# EAGLE design RCU_PCB (EAGLE 9.6.1)

## Sheet 1 of 3
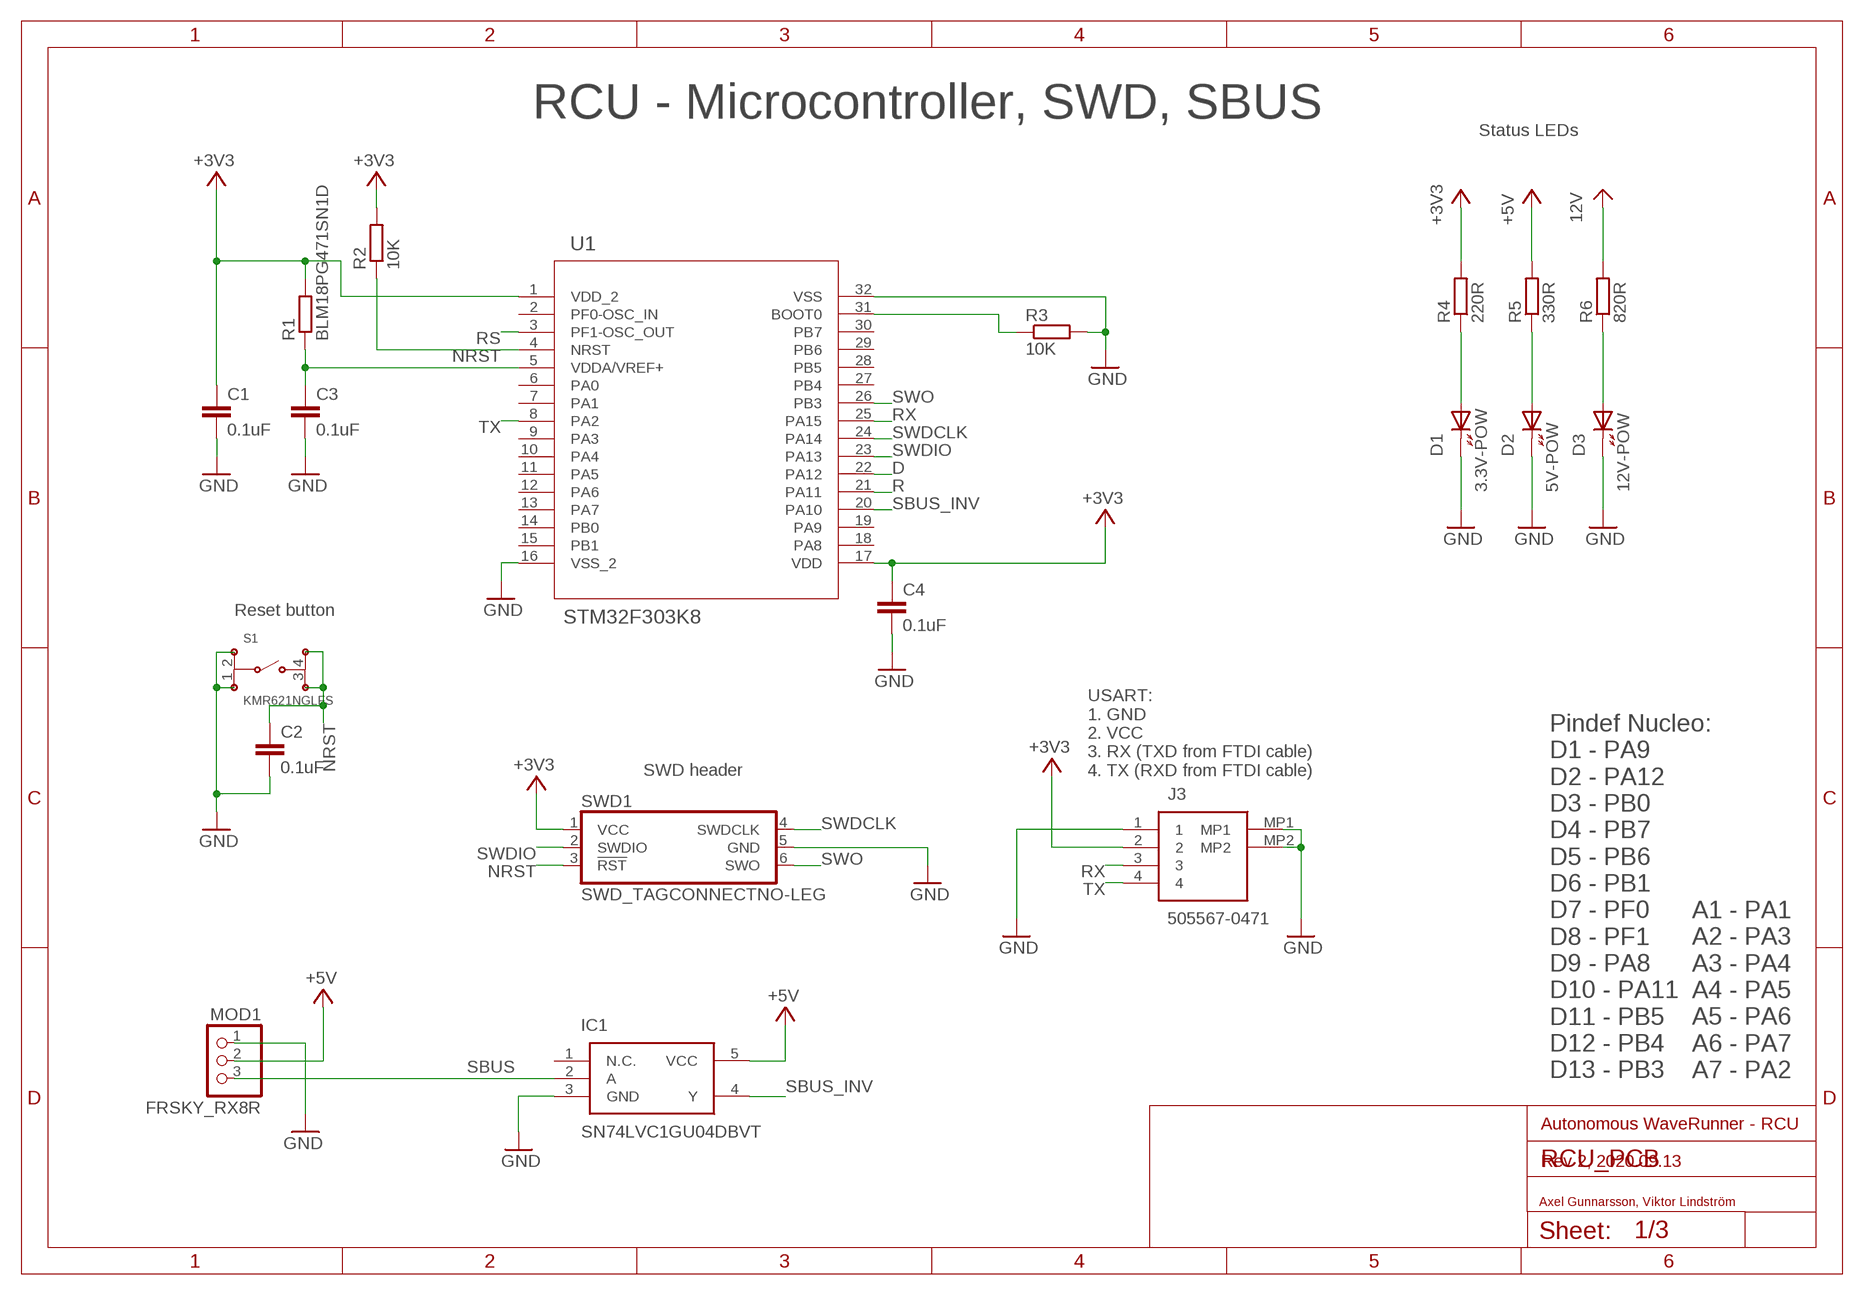
[diagram p0: schematic, sheet 1]

### Parts
C1  0.1uF  C0603  [C0603]
C2  0.1uF  C0603  [C0603]
C3  0.1uF  C0603  [C0603]
C4  0.1uF  C0603  [C0603]
D1  3.3V-POW  CHIP-LED0805  [CHIP-LED0805]
D2  5V-POW  CHIP-LED0805  [CHIP-LED0805]
D3  12V-POW  CHIP-LED0805  [CHIP-LED0805]
IC1  SN74LVC1GU04DBVT  [SOT95P280X145-5N]
J3  505567-0471  [5055680471]
MOD1  FRSKY_RX8R  [FRSKY_RX8R]
R1  BLM18PG471SN1D  R0603  [R0603]
R2  10K  R0603  [R0603]
R3  10K  R0603  [R0603]
R4  220R  R0603  [R0603]
R5  330R  R0603  [R0603]
R6  820R  R0603  [R0603]
S1  KMR621NGLFS  [KMR621NGLFS]
SWD1  SWD_TAGCONNECTNO-LEG  [TC2030-IDC-NL]
U1  STM32F303K8  [LQFP-32]

### Nets
12V: R6.2 ; also sheet 2,3
+3V3: C1.1 C4.1 J3.2 R1.2 R2.2 R4.2 SWD1.1(VCC) U1.1(VDD_2) U1.17(VDD) ; also sheet 2,3
+5V: IC1.5(VCC) MOD1.2 R5.2 ; also sheet 2
D: U1.22(PA12) ; also sheet 3
GND: C1.2 C2.2 C3.2 C4.2 D1.C(K) D2.C(K) D3.C(K) IC1.3(GND) J3.1 J3.MP1 J3.MP2 MOD1.1 R3.2 S1.1 S1.2 SWD1.5(GND) U1.16(VSS_2) U1.32(VSS) ; also sheet 2,3
N$10: D3.A R6.1
N$17: D2.A R5.1
N$40: C3.1 R1.1 U1.5(VDDA/VREF+)
N$42: D1.A R4.1
N$61: R3.1 U1.31(BOOT0)
NRST: C2.1 R2.1 S1.3 S1.4 SWD1.3(!RST) U1.4(NRST)
R: U1.21(PA11) ; also sheet 3
RS: U1.3(PF1-OSC_OUT) ; also sheet 3
RX: J3.3 U1.25(PA15)
SBUS: IC1.2(A) MOD1.3
SBUS_INV: IC1.4(Y) U1.20(PA10)
SWDCLK: SWD1.4(SWDCLK) U1.24(PA14)
SWDIO: SWD1.2(SWDIO) U1.23(PA13)
SWO: SWD1.6(SWO) U1.26(PB3)
TX: J3.4 U1.8(PA2)
Unconnected: IC1.1(N.C.) U1.2(PF0-OSC_IN) U1.6(PA0) U1.7(PA1) U1.9(PA3) U1.10(PA4) U1.11(PA5) U1.12(PA6) U1.13(PA7) U1.14(PB0) U1.15(PB1) U1.18(PA8) U1.19(PA9) U1.27(PB4) U1.28(PB5) U1.29(PB6) U1.30(PB7)

### Notes on the sheet
- RCU - Microcontroller, SWD, SBUS
- Status LEDs
- Reset button
- SWD header
- USART:
  1. GND
  2. VCC
  3. RX (TXD from FTDI cable)
  4. TX (RXD from FTDI cable)
- Pindef Nucleo:
  D1 - PA9
  D2 - PA12
  D3 - PB0
  D4 - PB7
  D5 - PB6
  D6 - PB1
  D7 - PF0
  D8 - PF1
  D9 - PA8
  D10 - PA11
  D11 - PB5
  D12 - PB4
  D13 - PB3
- A1 - PA1
  A2 - PA3
  A3 - PA4
  A4 - PA5
  A5 - PA6
  A6 - PA7
  A7 - PA2
- Autonomous WaveRunner - RCU
- Rev 2, 2020.09.13
- Axel Gunnarsson, Viktor Lindström

## Sheet 2 of 3
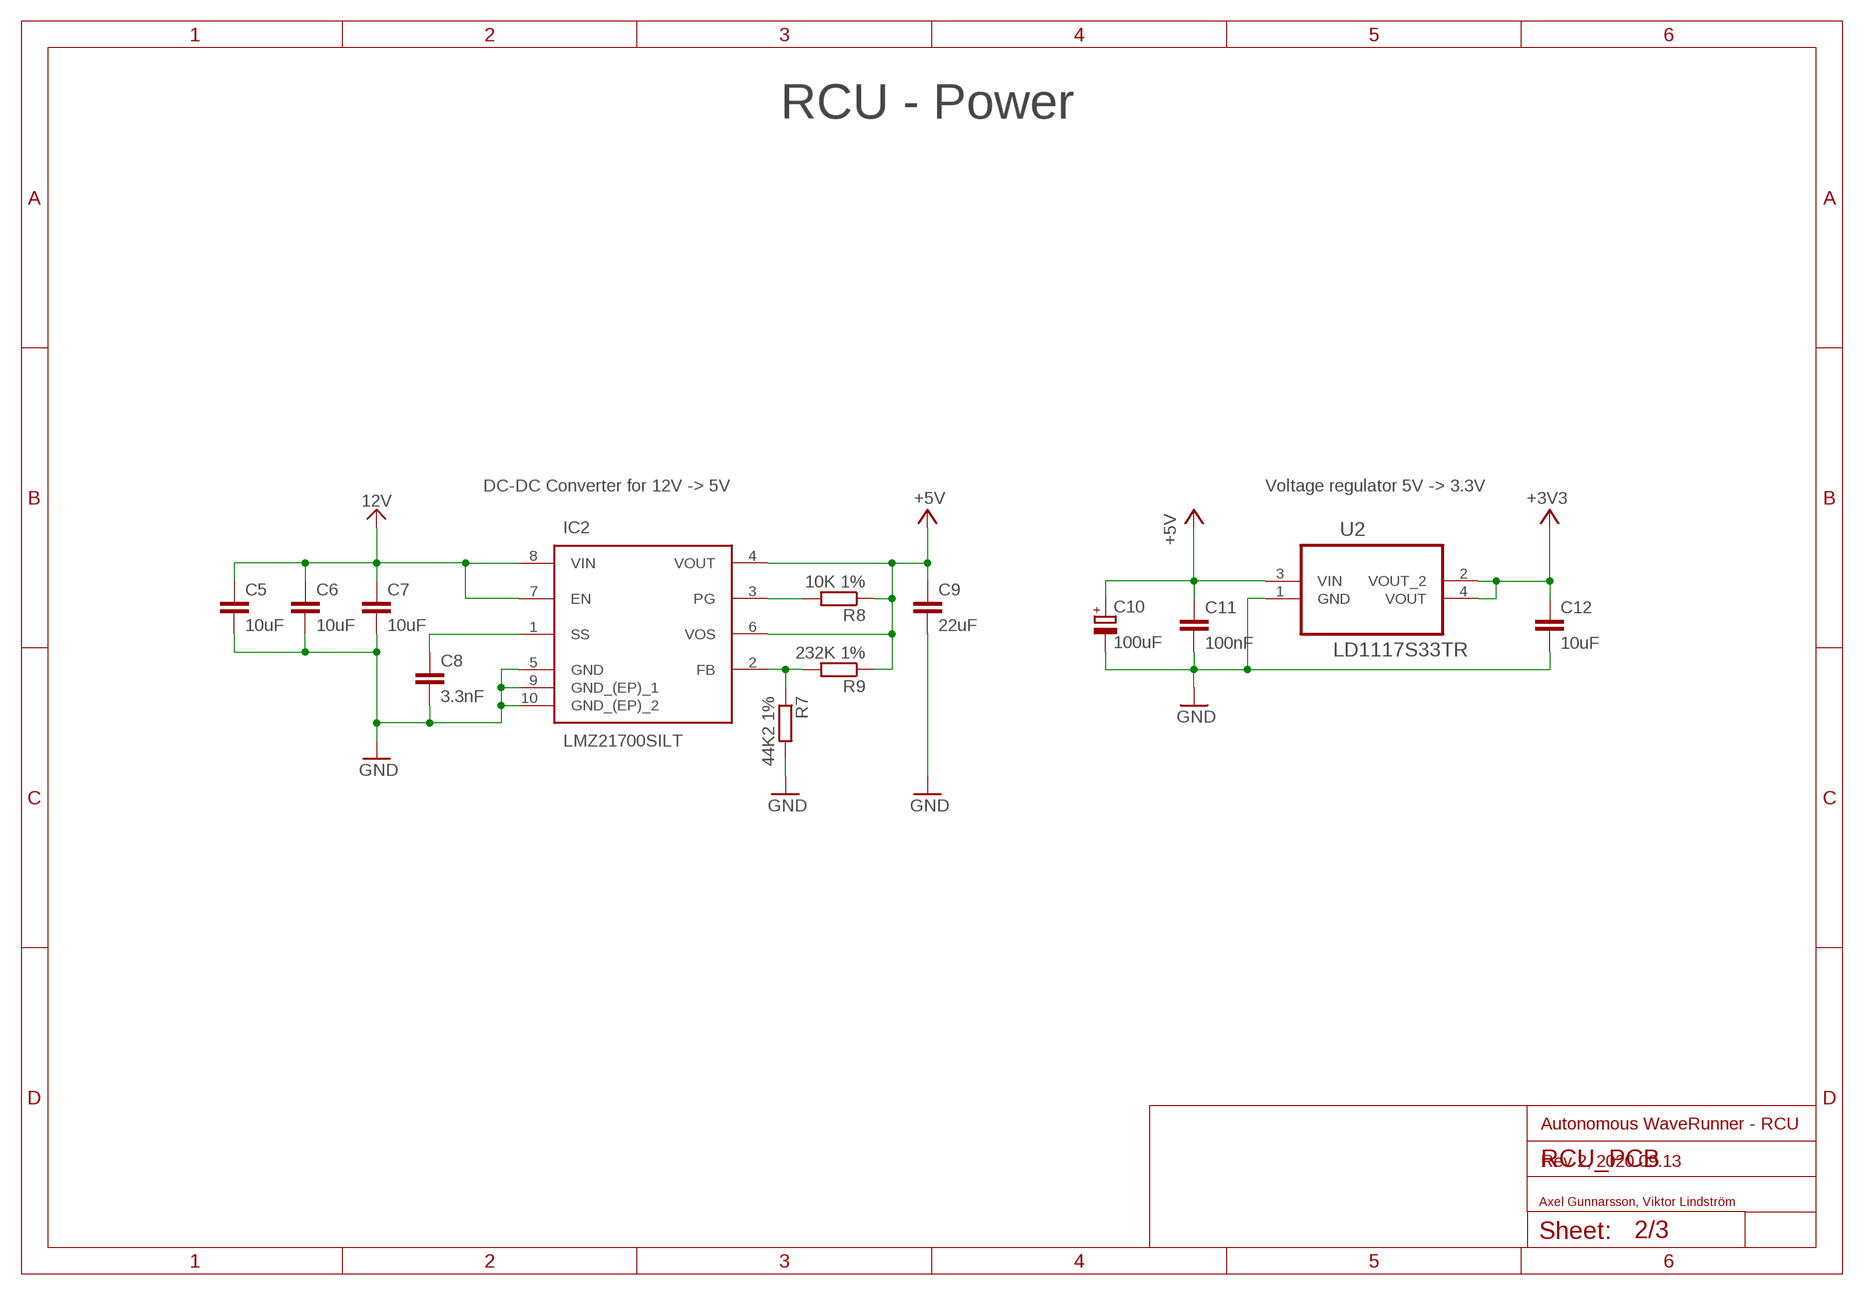
[diagram p1: schematic, sheet 2]

### Parts
C5  10uF  C1206  [C1206]
C6  10uF  C1206  [C1206]
C7  10uF  C1206  [C1206]
C8  3.3nF  C0603  [C0603]
C9  22uF  C0805  [C0805]
C10  100uF  PANASONIC_C  [PANASONIC_C]
C11  100nF  C0603  [C0603]
C12  10uF  C0805  [C0805]
IC2  LMZ21700SILT  [SIL0008E]
R7  44K2 1%  R0603  [R0603]
R8  10K 1%  R0603  [R0603]
R9  232K 1%  R0603  [R0603]
U2  LD1117S33TR  [SOT230P700X180-4N]

### Nets
12V: C5.1 C6.1 C7.1 IC2.7(EN) IC2.8(VIN) ; also sheet 1,3
+3V3: C12.1 U2.2(VOUT_2) U2.4(VOUT) ; also sheet 1,3
+5V: C9.1 C10.+ C11.1 IC2.4(VOUT) IC2.6(VOS) R8.1 R9.1 U2.3(VIN) ; also sheet 1
GND: C5.2 C6.2 C7.2 C8.2 C9.2 C10.- C11.2 C12.2 IC2.5(GND) IC2.9(GND_(EP)_1) IC2.10(GND_(EP)_2) R7.2 U2.1(GND) ; also sheet 1,3
N$5: IC2.2(FB) R7.1 R9.2
N$6: C8.1 IC2.1(SS)
N$11: IC2.3(PG) R8.2

### Notes on the sheet
- RCU - Power
- DC-DC Converter for 12V -> 5V | Voltage regulator 5V -> 3.3V
- Autonomous WaveRunner - RCU
- Rev 2, 2020.09.13
- Axel Gunnarsson, Viktor Lindström

## Sheet 3 of 3
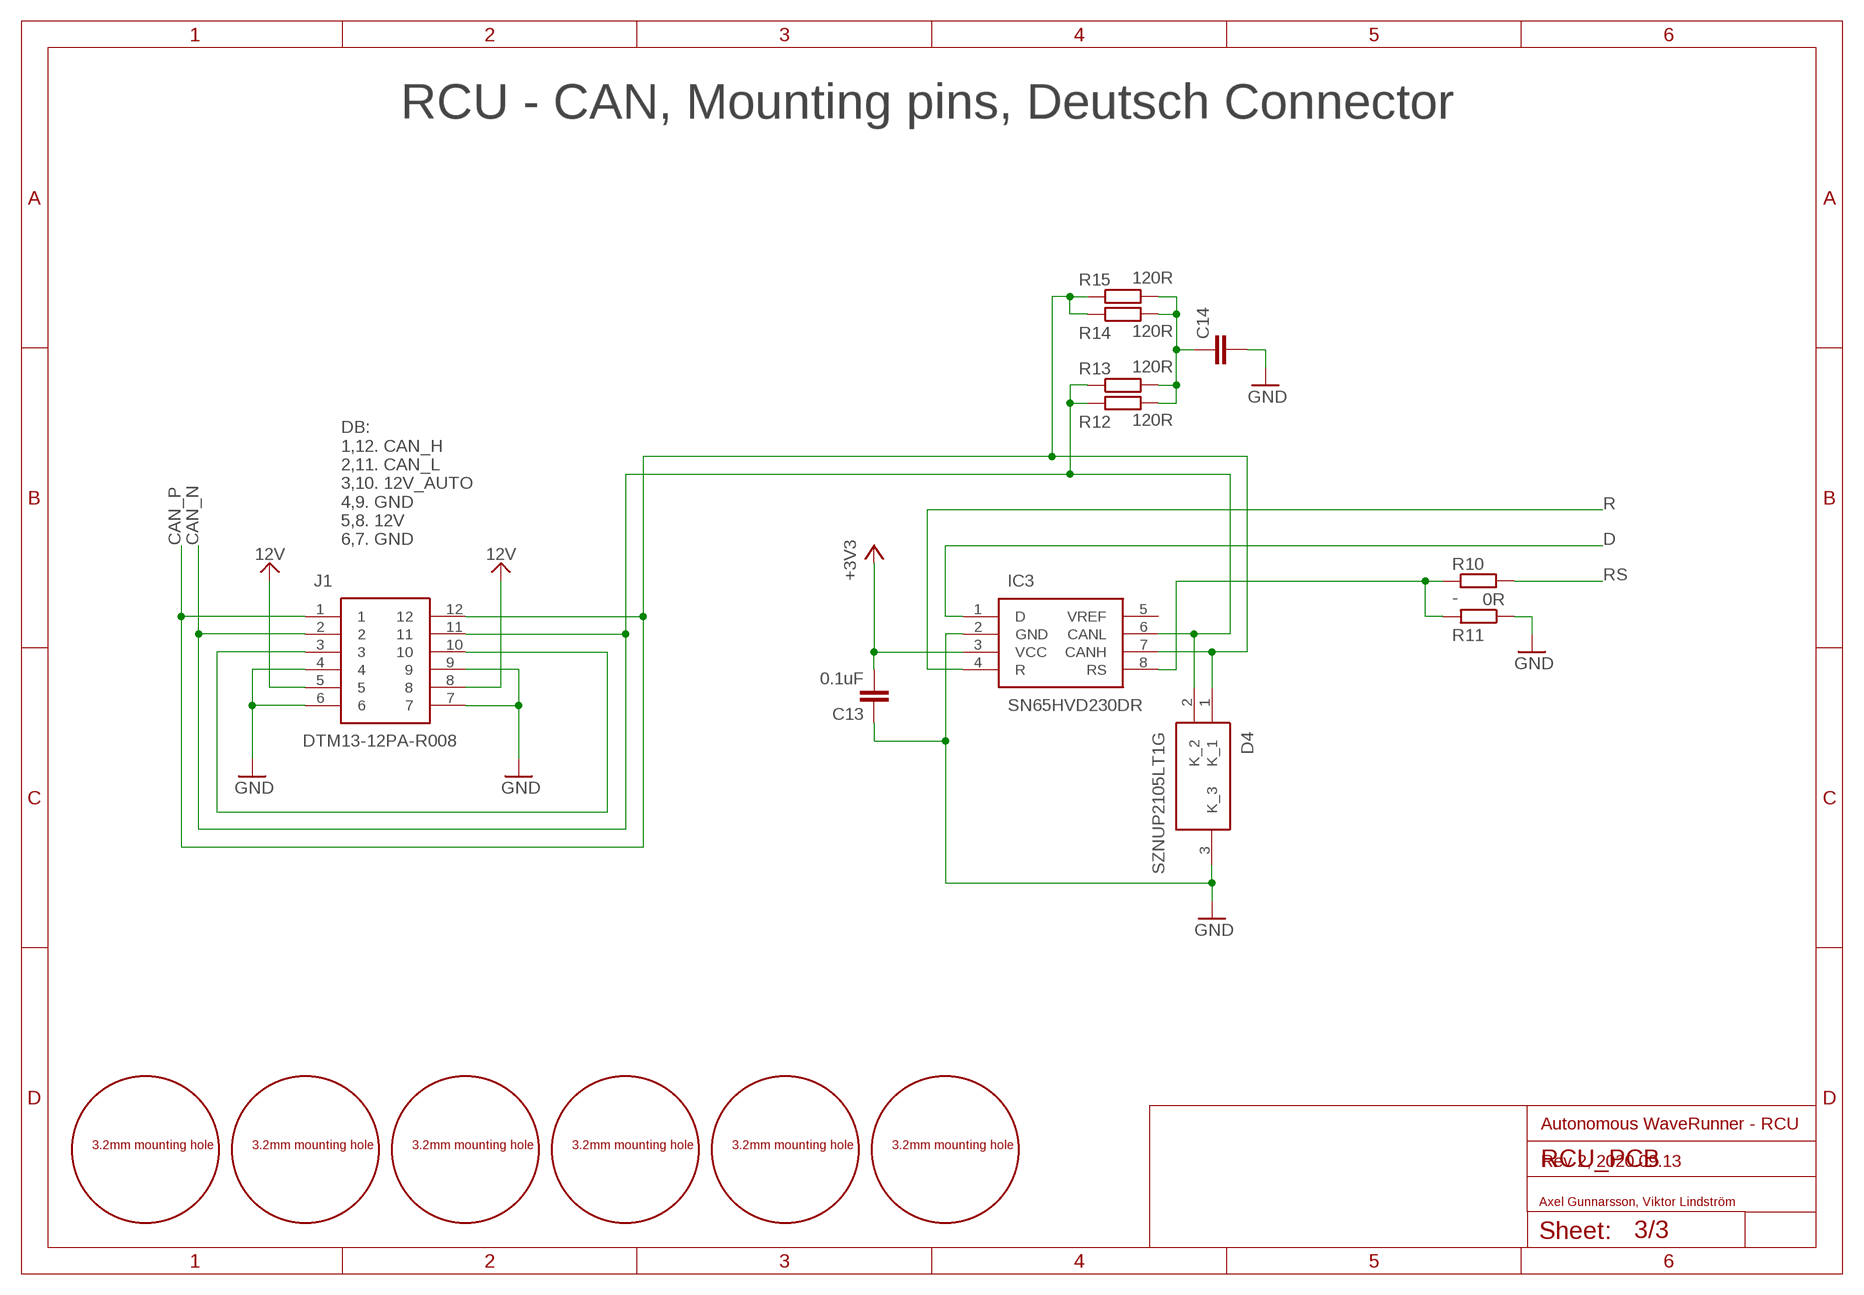
[diagram p2: schematic, sheet 3]

### Parts
C13  0.1uF  C0603  [C0603]
C14  C0805  [C0805]
D4  SZNUP2105LT1G  [SOT96P237X111-3N]
HOLE1  M3_MOUNTING_HOLE  [M3_MOUNTING_HOLE]
HOLE2  M3_MOUNTING_HOLE  [M3_MOUNTING_HOLE]
HOLE3  M3_MOUNTING_HOLE  [M3_MOUNTING_HOLE]
HOLE4  M3_MOUNTING_HOLE  [M3_MOUNTING_HOLE]
HOLE5  M3_MOUNTING_HOLE  [M3_MOUNTING_HOLE]
HOLE6  M3_MOUNTING_HOLE  [M3_MOUNTING_HOLE]
IC3  SN65HVD230DR  [SOT127P600X175-8N]
J1  DTM13-12PA-R008  [DTM1312PAR008]
R10  -  R0603  [R0603]
R11  0R  R0603  [R0603]
R12  120R  R-EU_R1210  [R1210]
R13  120R  R-EU_R1210  [R1210]
R14  120R  R-EU_R1210  [R1210]
R15  120R  R-EU_R1210  [R1210]

### Nets
12V: J1.5 J1.8 ; also sheet 1,2
+3V3: C13.2 IC3.3(VCC) ; also sheet 1,2
CAN_N: D4.2(K_2) IC3.6(CANL) J1.2 J1.11 R12.1 R13.1
CAN_P: D4.1(K_1) IC3.7(CANH) J1.1 J1.12 R14.1 R15.1
D: IC3.1(D) ; also sheet 1
GND: C13.1 C14.2 D4.3(K_3) IC3.2(GND) J1.4 J1.6 J1.7 J1.9 R11.1 ; also sheet 1,2
N$1: C14.1 R12.2 R13.2 R14.2 R15.2
N$7: J1.3 J1.10
N$15: IC3.8(RS) R10.1 R11.2
R: IC3.4(R) ; also sheet 1
RS: R10.2 ; also sheet 1
Unconnected: IC3.5(VREF)

### Notes on the sheet
- RCU - CAN, Mounting pins, Deutsch Connector
- DB:
  1,12. CAN_H
  2,11. CAN_L
  3,10. 12V_AUTO
  4,9. GND 
  5,8. 12V
  6,7. GND
- Autonomous WaveRunner - RCU
- Rev 2, 2020.09.13
- Axel Gunnarsson, Viktor Lindström

## Library data of the parts
C1-C4 C8 C11 C13 = CASE-RCL:C0603: Standard Chip CAPACITOR 0605 (1608 Metric) Description: Standard Chip CAPACITOR 0605 (1608 Metric)
C5-C7 = CASE-RCL:C1206: Standard Chip CAPACITOR 1206 (3216 Metric) Description: Standard Chip CAPACITOR 1206 (3216 Metric)
C9 C12 C14 = CASE-RCL:C0805: Standard Chip CAPACITOR 0805 (2012 Metric) Description: Standard Chip CAPACITOR 0805 (2012 Metric)
C10 = CASE-RCL:PANASONIC_C: Panasonic VS Type Aluminum Electrolytic SMD Capacitors Size C - (TEAPO D5) Description: Size C of VS type SMD capacitor from Panasonic. Diameter of cap = 5mm. (TEAPO D5) Links: TEAPO1 <http://www.farnell.com/datasheets/2622415.pdf?_ga=2.91453018.1951585514.1537363662-1535130828.1530438260> TEAPO2 <http://www.teapo.com.tw/WebSiteFile/Products/Product_Data/EV%20%20SPEC.pdf> PANASONIC <https://industrial.panasonic.com/cdbs/www-data/pdf/RDE0000/DME0000COL92.pdf>
D1-D3 = CASE-LED:CHIP-LED0805: CHIP-LED0805 (SMD) Description: Standard 0805 SMD CHIP-LED
D4 = RescueRunner:SZNUP2105LT1G: Dual Bi-Directional TVS Diode, 350W peak, 3-pin SOT-23 Source: Datasheet <https://componentsearchengine.com/Datasheets/1/SZNUP2105LT1G.pdf>; DESCRIPTION: Dual Bi-Directional TVS Diode, 350W peak, 3-pin SOT-23; HEIGHT: 1.11mm; MANUFACTURER_NAME: ON Semiconductor; MANUFACTURER_PART_NUMBER: SZNUP2105LT1G; MOUSER_PART_NUMBER: 863-SZNUP2105LT1G; MOUSER_PRICE-STOCK: https://www.mouser.com/Search/Refine.aspx?Keyword=863-SZNUP2105LT1G
HOLE1-HOLE4 = RescueRunner:M3_MOUNTING_HOLE
HOLE5 HOLE6 = RescueRunner:M3_MOUNTING_HOLE; SPICEPREFIX: X
IC1 = Unicorn_ACU_LIB:SN74LVC1GU04DBVT: 74LVC Single Unbuffered Inverter SOT23 Texas Instruments SN74LVC1GU04DBVT CMOS Inverter, 1.65 5.5 V SOT-23, 5-Pin Source: Datasheet <http://uk.rs-online.com/web/p/products/7968253P>; DESCRIPTION: 74LVC Single Unbuffered Inverter SOT23 Texas Instruments SN74LVC1GU04DBVT CMOS Inverter, 1.65 5.5 V SOT-23, 5-Pin; HEIGHT: 1.45mm; MANUFACTURER_NAME: Texas Instruments; MANUFACTURER_PART_NUMBER: SN74LVC1GU04DBVT; RS_PART_NUMBER: 7968253P; RS_PRICE-STOCK: http://uk.rs-online.com/web/p/products/7968253P
IC2 = RescueRunner:LMZ21700SILT: 3V to 17V, 0.65A Step-Down DC/DC Power Module in 3.5mm 3.5mm Package Source: Datasheet <http://uk.rs-online.com/web/p/products/9009750P>; DESCRIPTION: 3V to 17V, 0.65A Step-Down DC/DC Power Module in 3.5mm 3.5mm Package; HEIGHT: mm; MANUFACTURER_NAME: Texas Instruments; MANUFACTURER_PART_NUMBER: LMZ21700SILT; RS_PART_NUMBER: 9009750P; RS_PRICE-STOCK: http://uk.rs-online.com/web/p/products/9009750P
IC3 = RescueRunner:SN65HVD230DR: 3.3 V CAN Transceiver with Standby Mode Source: Datasheet <http://www.ti.com/lit/gpn/sn65hvd230>; DESCRIPTION: 3.3 V CAN Transceiver with Standby Mode; HEIGHT: 1.75mm; MANUFACTURER_NAME: Texas Instruments; MANUFACTURER_PART_NUMBER: SN65HVD230DR; MOUSER_PART_NUMBER: 595-SN65HVD230DR; MOUSER_PRICE-STOCK: https://www.mouser.com/Search/Refine.aspx?Keyword=595-SN65HVD230DR
J1 = RCU_lib:DTM13-12PA-R008: Deutsch DTM, 4.19mm Pitch, 12 Way, 2 Row, Right Angle PCB Header, Panel Mount, Through Hole Source: Datasheet <http://uk.rs-online.com/web/p/products/7242563>; ALLIED_NUMBER: 70696164; DESCRIPTION: Deutsch DTM, 4.19mm Pitch, 12 Way, 2 Row, Right Angle PCB Header, Panel Mount, Through Hole; HEIGHT: 35mm; MANUFACTURER_NAME: TE Connectivity; MANUFACTURER_PART_NUMBER: DTM13-12PA-R008; RS_PART_NUMBER: 7242563; RS_PRICE-STOCK: http://uk.rs-online.com/web/p/products/7242563
J3 = Unicorn_ACU_LIB:505567-0471: Vertical
MOD1 = RCU_lib:FRSKY_RX8R
R1-R11 = CASE-RCL:R0603: Standard Chip RESISTOR 0603 (1608 Metric) Description: Standard Chip RESISTOR 0603 (1608 Metric)
R12-R15 = rcl:R-EU_: RESISTOR, European symbol; SPICEPREFIX: R
S1 = CASE-Switches:KMR621NGLFS: C&K KMR621NG LFS Tactile SPST switch (SMD) Description: C&K KMR621NG LFS Tactile SPST switch SMD package. Links: KMR621NG LFS <http://www.farnell.com/datasheets/2706242.pdf?_ga=2.40597409.2071720333.1546461288-1112771566.1525371275>
SWD1 = CASE-Prog_Header:SWD_TAGCONNECT: SWD Programming header (Tag-Connect version) Description: SWD Programming header for Tag Connect TC2030-IDC, both legged and no-legged version Links: Tag-Connect <http://www.tag-connect.com/JLINK>
U1 = CASE-MCU:STM32F303K8: STM32F303K8, LQFP-32 Description: STM32F303K8 from STMicroelectronics F3 series (Arm Cortex M4), LQFP-32 package Links: Datasheet <https://www.st.com/resource/en/datasheet/stm32f303k8.pdf> Website <https://www.st.com/en/microcontrollers/stm32f303k8.html> NUCLEO-F303K8 <https://www.st.com/en/evaluation-tools/nucleo-f303k8.html>; MANUFACTURER_PART_NUMBER: stm32f303_334kxt; VENDOR: STMicroelectronics
U2 = CASE-Voltage_regulators:LD1117S33TR: LD1117S33TR, 3.3V LDO voltage regulator, SOT-223-4 Description: LD1117S33TR, 3.3V LDO voltage regulator in SOT-223-3 package - Input voltage: 4.75-15V - Output voltage: 3.3V - Output current: 800mA - Dropout voltage: 1.1V Links: Datasheet <http://www.farnell.com/datasheets/1776449.pdf?_ga=2.71508627.1869469127.1547838600-114062766.1547494298>; MPN: LD1117S33TR; OC_FARNELL: 2253484; OC_NEWARK: 89K0627; PACKAGE: SOT223-3; SUPPLIER: STMicroelectronics

## Net classes
0 default: width 0.2 mm

## Board
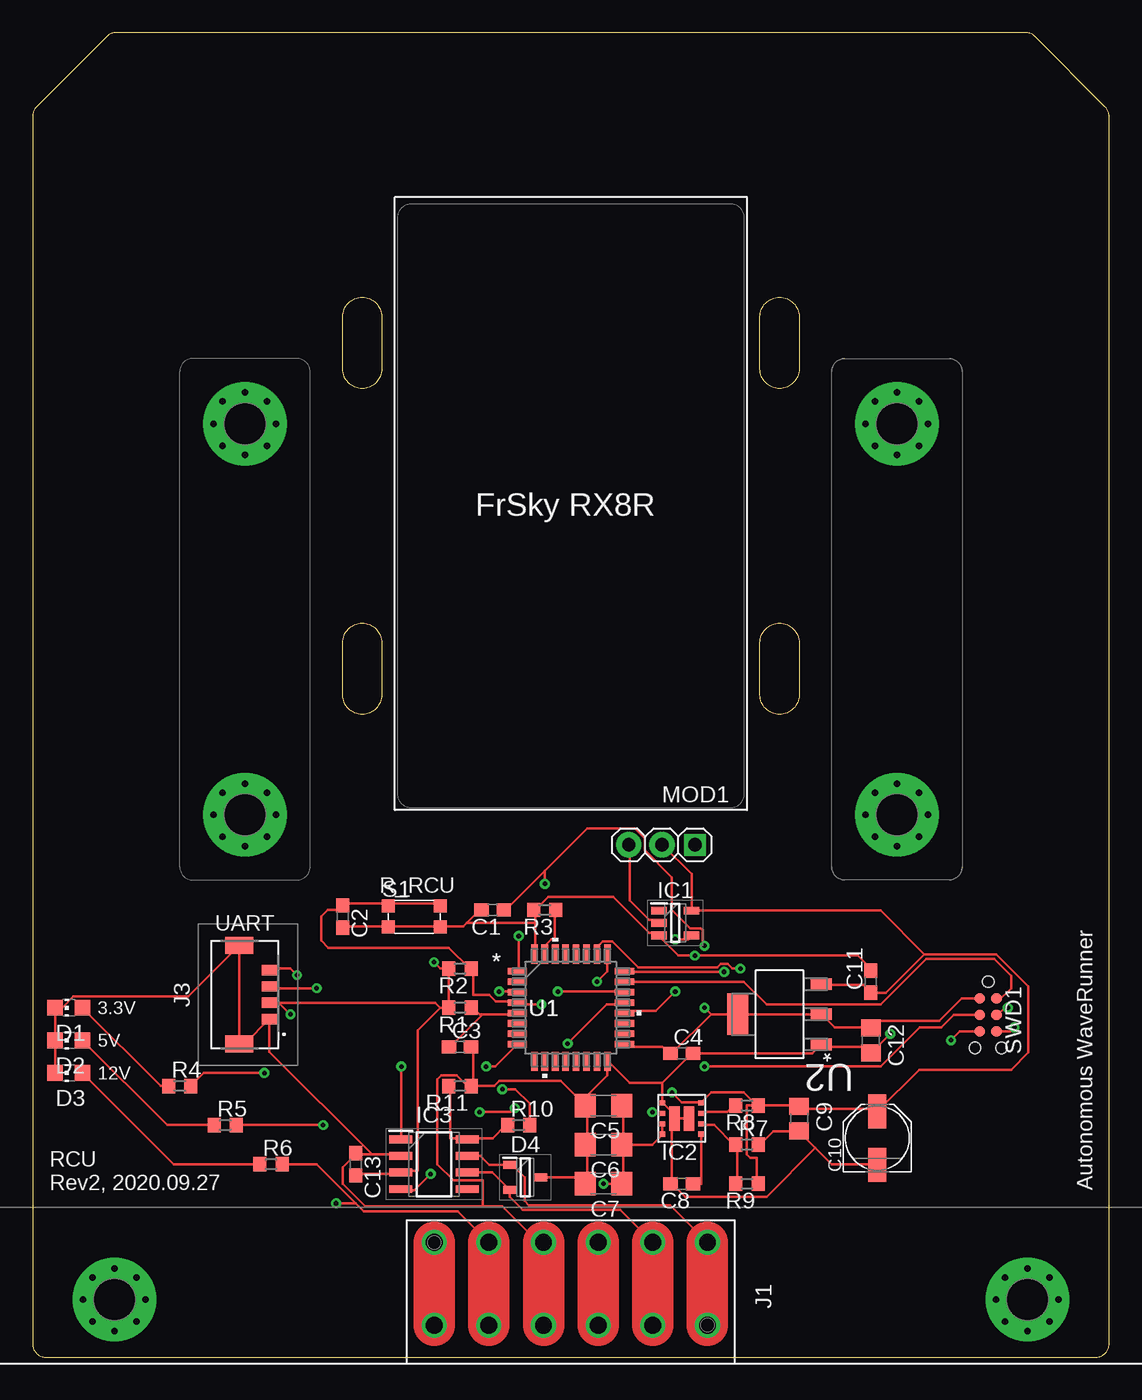
[diagram p3: board, top side]
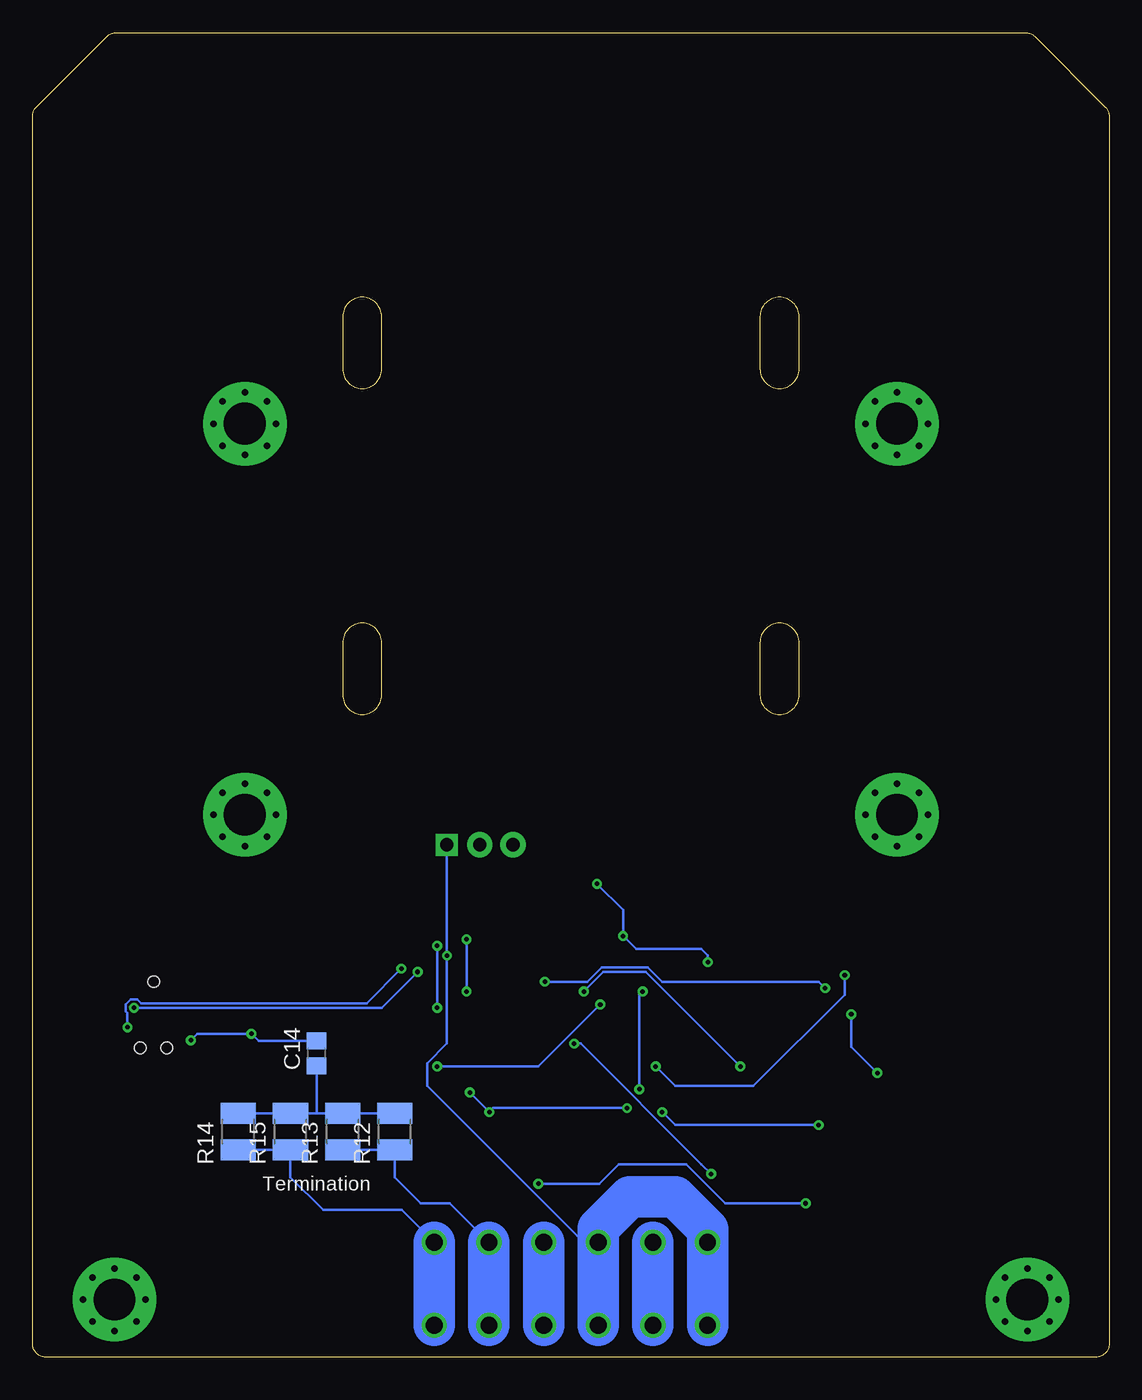
[diagram p4: board, bottom side, seen from below]

Size 82.55 x 101.6 mm. Coordinates in mm from the lower left corner, seen from the top.
Outline: 58.77,50.8 arc-180 55.77,50.8 55.77,54.8 arc-180 58.77,54.8 58.77,50.8
Outline: 26.77,50.8 arc-180 23.77,50.8 23.77,54.8 arc-180 26.77,54.8 26.77,50.8
Outline: 26.77,75.8 arc-180 23.77,75.8 23.77,79.8 arc-180 26.77,79.8 26.77,75.8
Outline: 58.77,75.8 arc-180 55.77,75.8 55.77,79.8 arc-180 58.77,79.8 58.77,75.8
Outline: 82.55,1 82.55,95.19 arc45 82.26,95.89 76.84,101.31 arc45 76.14,101.6 6.41,101.6 arc45 5.71,101.31 0.29,95.89 arc45 0,95.19 0,1 arc90 1,0 81.55,0 arc90 82.55,1
Copper layers (1*16): Top 0.035mm / dielectric 1.5mm / Bottom 0.035mm
Design rules "default": minimum track width 6mil, minimum drill 0.35mm, track to track 6mil, track to pad 6mil, pad to pad 6mil, via to via 6mil, smd to smd 6mil, copper to edge 40mil, drill to drill 6mil, minimum pad ring 10mil, minimum via ring 8mil, stop-mask expansion 4mil, vias tented up to drill 0mil, thermal gap 10mil

### Footprints (pad centres in the part's own frame; a part is rotated, then mirrored left to right if it is on the bottom)
C0603 = smd 1.1 x 1: 1 -0.85,0; 2 0.85,0
C1206 = smd 1.6 x 1.8: 1 -1.4,0; 2 1.4,0
C0805 = smd 1.3 x 1.5: 1 -0.95,0; 2 0.95,0
PANASONIC_C = smd 2.6 x 1.4: + 2.05,0; - -2.05,0
CHIP-LED0805 = smd 1.2 x 1.2: A 0,-1.05; C 0,1.05
SOT96P237X111-3N = smd 1 x 0.6: 1 -1.2,0.955; 2 -1.2,-0.955; 3 1.2,0
M3_MOUNTING_HOLE = drill 0.5 pad 0.8: P$1 -2.4,0; P$2 0,2.4; P$3 2.4,0; P$4 0,-2.4; P$5 -1.697,1.697; P$6 1.697,1.697; P$7 1.697,-1.697; P$8 -1.697,-1.697 | drill 3.2 pad 6.4: P$10 0,0
SOT95P280X145-5N = smd 1.2 x 0.6: 1 -1.25,0.95; 2 -1.25,0; 3 -1.25,-0.95; 4 1.25,-0.95; 5 1.25,0.95
SIL0008E = smd 0.45 x 0.4: 1 -1.475,1.2; 2 -1.475,0.4; 3 -1.475,-0.4; 4 -1.475,-1.2; 5 1.475,-1.2; 6 1.475,-0.4; 7 1.475,0.4; 8 1.475,1.2 | smd 0.8 x 1.9: 9 0.55,0; 10 -0.55,0
SOT127P600X175-8N = smd 1.75 x 0.6: 1 -2.55,1.905; 2 -2.55,0.635; 3 -2.55,-0.635; 4 -2.55,-1.905; 5 2.55,-1.905; 6 2.55,-0.635; 7 2.55,0.635; 8 2.55,1.905
DTM1312PAR008 = drill 1.29 pad 1.935: 1 0,0; 2 -4.19,0; 3 -8.38,0; 4 -12.57,0; 5 -16.76,0; 6 -20.95,0; 7 -20.95,6.35; 8 -16.76,6.35; 9 -12.57,6.35; 10 -8.38,6.35; 11 -4.19,6.35; 12 0,6.35
5055680471 = smd 0.8 x 1.2: 1 -1.865,-1.882; 2 -0.615,-1.882; 3 0.635,-1.882; 4 1.885,-1.882 | smd 1.3 x 2.15: MP1 -3.765,0.412; MP2 3.765,0.412
FRSKY_RX8R = drill 1.016 pad 1.676 square: 1 -2.54,0 | drill 1.016 pad 1.93: 2 0,0; 3 2.54,0
R0603 = smd 1 x 1.1: 1 -0.85,0; 2 0.85,0
R1210 = smd 1.6 x 2.7: 1 -1.4,0; 2 1.4,0
KMR621NGLFS = smd 1 x 1: 1 -2,-0.8; 2 2,-0.8; 3 -2,0.8; 4 2,0.8
TC2030-IDC-NL = smd 0.787 x 0.787: 1 1.27,-0.635; 2 1.27,0.635; 3 2.54,-0.635; 4 2.54,0.635; 5 3.81,-0.635; 6 3.81,0.635 | hole 0.889: 0,0; 5.08,-1.016; 5.08,1.016
LQFP-32 = smd 1.473 x 0.508: 1 -4.115,2.8; 2 -4.115,2; 3 -4.115,1.2; 4 -4.115,0.4; 5 -4.115,-0.4; 6 -4.115,-1.2; 7 -4.115,-2; 8 -4.115,-2.8; 17 4.115,-2.8; 18 4.115,-2; 19 4.115,-1.2; 20 4.115,-0.4; 21 4.115,0.4; 22 4.115,1.2; 23 4.115,2; 24 4.115,2.8 | smd 0.508 x 1.473: 9 -2.8,-4.115; 10 -2,-4.115; 11 -1.2,-4.115; 12 -0.4,-4.115; 13 0.4,-4.115; 14 1.2,-4.115; 15 2,-4.115; 16 2.8,-4.115; 25 2.8,4.115; 26 2,4.115; 27 1.2,4.115; 28 0.4,4.115; 29 -0.4,4.115; 30 -1.2,4.115; 31 -2,4.115; 32 -2.8,4.115
SOT230P700X180-4N = smd 1.626 x 0.889: 1 -3.2,2.311; 2 -3.2,0; 3 -3.2,-2.311 | smd 1.626 x 3.175: 4 3.2,0

### Placement (x,y rotation side)
C1  35.27,34.3 180 top
C2  23.77,33.8 270 top
C3  32.77,23.8 0 top
C4  49.77,23.3 0 top
C5  43.77,19.3 180 top
C6  43.77,16.3 180 top
C7  43.77,13.3 180 top
C8  49.77,13.3 180 top
C9  58.77,18.3 270 top
C10  64.78,16.8 90 top
C11  64.28,28.8 90 top
C12  64.28,24.3 270 top
C13  24.77,14.8 270 top
C14  60.77,23.3 90 bottom
D1  2.77,26.8 90 top
D2  2.77,24.3 90 top
D3  2.77,21.8 90 top
D4  37.77,13.8 0 top
HOLE1  16.27,41.6 0 top
HOLE2  6.27,4.41 0 top
HOLE3  76.28,4.41 0 top
HOLE4  16.27,71.6 0 top
HOLE5  66.28,41.6 0 top
HOLE6  66.28,71.6 0 top
IC1  49.27,33.3 0 top
IC2  49.77,18.3 180 top
IC3  30.77,14.8 0 top
J1  51.74,2.45 0 top
J3  16.27,27.8 90 top
MOD1  48.25,39.3 180 top
R1  32.77,26.8 180 top
R2  32.77,29.8 180 top
R3  39.27,34.3 180 top
R4  11.27,20.8 0 top
R5  14.77,17.8 0 top
R6  18.27,14.8 0 top
R7  54.77,16.3 0 top
R8  54.77,19.3 180 top
R9  54.77,13.3 180 top
R10  37.27,17.8 0 top
R11  32.77,20.8 180 top
R12  54.77,17.3 90 bottom
R13  58.77,17.3 90 bottom
R14  66.78,17.3 90 bottom
R15  62.77,17.3 90 bottom
S1  29.27,33.8 0 top
SWD1  73.28,28.8 270 top
U1  41.27,26.8 0 top
U2  57.27,26.3 180 top

### Tracks (layer width: path | path; a pad name or v marks a point on that pad's centre or on a via)
12V  (via drill 0.35)
  Top 0.2: 48.27,17.05 48.27,17.8 IC2.7 | 48.27,17.05 47.52,16.3 45.27,16.3 | 48.27,17.05 IC2.8 | 45.27,16.3 45.27,13.3 C7.1 v43.77,13.3 | 45.27,16.3 45.27,19.3 C5.1 | 45.27,16.3 C6.1 | J1.8 32.59,11.2 25.38,11.2 24.78,11.8 | R6.2 21.78,14.8 24.78,11.8 | v23.27,11.8 24.77,11.8 24.78,11.8
  Top 3.2: J1.5 J1.8
  Bottom 0.2: v43.77,13.3 39.11,13.3 37.6,14.8 32.45,14.8 29.44,11.8 v23.27,11.8
  Bottom 3.2: J1.5 J1.8
+3V3  (via drill 0.35)
  Top 0.2: SWD1.1 71.25,27.53 69.53,25.8 64.78,25.8 64.28,25.3 | 64.28,25.3 61.52,25.3 60.52,26.3 U2.2 U2.4 52.02,26.3 | 64.28,25.3 C12.1 | U1.17 45.52,23.8 48.27,23.8 48.77,23.3 C4.1 49.02,23.3 52.02,26.3 | C13.2 24.77,14.05 28.02,14.05 IC3.3 28.27,14.3 29.52,14.3 29.52,25.05 31.27,26.8 | 39.27,37.3 42.52,40.55 46.19,40.55 46.93,39.8 46.93,38.89 49.02,36.8 49.02,34.3 50.42,32.9 51.23,32.9 51.38,32.75 51.38,31.7 v51.52,31.55 | 39.27,37.3 36.27,34.3 C1.1 | v51.52,26.8 52.02,26.3 | v39.27,36.3 39.27,37.3 | v37.27,32.3 37.27,29.71 U1.1 | v30.77,30.3 31.27,29.8 R2.2 R1.2 31.27,26.8 | J3.2 18.89,27.18 | 18.89,27.18 30.89,27.18 31.27,26.8 | R4.2 13.12,21.8 v17.77,21.8 | v19.77,26.3 18.89,27.18
  Bottom 0.2: v51.52,31.55 v51.52,26.8 | v39.27,36.3 37.27,34.3 v37.27,32.3 36.27,31.3 31.27,31.3 30.77,30.8 v30.77,30.3 | v17.77,21.8 19.77,23.8 v19.77,26.3
+5V  (via drill 0.35)
  Top 0.2: v47.52,18.8 48.27,18.8 IC2.6 | v49.02,20.3 49.77,19.55 51.27,19.55 | 55.52,19.3 54.77,19.3 54.77,15.55 55.02,15.3 55.52,15.3 55.52,13.3 R9.1 | 51.27,19.55 52.02,20.3 54.52,20.3 55.52,19.3 | 51.27,19.55 IC2.4 | 55.52,19.3 R8.1 58.77,19.3 C9.1 58.77,19.05 64.78,19.05 C10.+ 67.97,22.05 75.03,22.05 76.35,23.38 76.35,28.43 73.88,30.9 68.38,30.9 | U2.3 60.52,28.55 63.77,28.55 64.28,28.05 C11.1 65.43,27.95 68.38,30.9 | MOD1.2 48.27,39.3 50.52,37.05 IC1.5 65.03,34.25 68.38,30.9 | R5.2 v22.27,17.8 | v34.27,18.8 36.67,18.8 v36.97,19.1
  Bottom 0.2: v49.02,20.3 v47.52,18.8 47.22,19.1 v36.97,19.1 | v22.27,17.8 33.27,17.8 v34.27,18.8
CAN_N
  Top 0.2: J1.11 45.05,11.3 37.58,11.3 36.57,12.3 D4.2 35.25,14.16 IC3.6
  Top 3.2: J1.2 J1.11
  Bottom 0.2: J1.11 50.55,11.8 52.77,11.8 54.77,13.8 R12.1 R13.1
  Bottom 3.2: J1.2 J1.11
CAN_P
  Top 0.2: J1.12 48.89,11.65 38.05,11.65 37.72,11.98 37.72,13.81 36.77,14.75 D4.1 35,14.75 34.32,15.43 IC3.7
  Top 3.2: J1.1 J1.12
  Bottom 0.2: J1.12 54.24,11.3 60.27,11.3 62.77,13.8 R15.1 R14.1
  Bottom 3.2: J1.1 J1.12
D  (via drill 0.35)
  Top 0.2: v40.27,28.05 45.27,28.05 U1.22 | v28.27,22.3 28.27,16.8 IC3.1
  Bottom 0.2: v40.27,28.05 38.77,29.55 35.52,29.55 v28.27,22.3
GND  (via drill 0.35)
  Top 0.2: 38.52,33.3 38.52,31.05 U1.32 | 38.52,33.3 38.52,34.3 | 27.27,33.05 23.77,33.05 C2.2 | 27.27,33.05 31.27,33.05 | 27.27,33.05 S1.1 | 33.27,33.3 33.02,33.05 31.27,33.05 | 33.27,33.3 34.27,34.3 C1.2 | 31.27,33.05 S1.2 | 33.27,33.3 38.52,33.3 | C11.2 64.28,29.8 63.27,30.8 v50.77,30.8 49.52,30.8 48.02,32.3 IC1.3 48.02,32.55 47.27,32.55 44.52,35.3 39.52,35.3 38.52,34.3 | 38.52,34.3 R3.2 | 26.02,15.55 28.02,15.55 IC3.2 | 26.02,15.55 24.77,15.55 | 26.02,15.55 18.16,23.42 J3.1 16.26,24.03 J3.MP1 J3.MP2 11.95,27.65 3.12,27.65 2.27,26.8 D1.C D2.C D3.C | 34.52,11.55 36.02,11.55 38.77,8.8 J1.9 | 24.77,15.55 23.77,14.55 23.77,13.3 25.52,11.55 34.52,11.55 | 24.77,15.55 C13.1 | 58.77,17.3 56.77,17.3 55.77,16.3 R7.2 | 60.02,16.05 61.27,14.8 64.78,14.8 C10.- | 60.02,16.05 58.77,17.3 | 58.77,17.3 C9.2 | 42.52,19.3 42.52,16.3 | 42.52,16.3 42.52,13.3 | 42.52,13.3 C7.2 | 42.52,16.3 C6.2 | 49.02,13.3 49.02,18.3 IC2.9 49.27,18.3 49.27,18.55 | R11.1 33.77,20.8 33.77,23.8 C3.2 | 49.27,18.55 49.52,18.3 IC2.10 | 49.27,18.55 48.27,19.55 | 48.27,21.05 50.52,23.3 C4.2 59.77,23.3 60.27,23.8 U2.1 60.52,23.8 64.03,23.8 64.28,23.55 C12.2 64.33,23.35 v65.78,24.8 | 48.27,19.55 48.27,21.05 | 48.27,19.55 IC2.5 | 48.27,21.05 45.77,21.05 44.27,22.55 U1.16 44.07,21.6 42.27,19.8 42.27,19.55 42.52,19.3 | 42.52,19.3 C5.2 40.49,21.18 35.76,21.18 35.38,20.8 R11.1 | 60.02,16.05 56.27,12.3 50.02,12.3 49.02,13.3 | 49.02,13.3 C8.2 | 34.52,11.55 34.52,13.55 32.27,13.55 31.02,14.8 31.02,21.31 31.32,21.6 32.53,21.6 33.33,20.8 R11.1 | SWD1.5 71.11,24.99 v70.42,24.3 | 42.52,13.3 42.02,13.8 D4.3
  Top 3.2: J1.6 J1.7 | J1.4 J1.9
  Bottom 0.2: MOD1.1 50.77,39.3 v50.77,30.8 50.77,24.05 52.27,22.55 52.27,20.8 40.77,9.3 39.67,9.3 J1.9 | v70.42,24.3 69.92,24.8 v65.78,24.8 65.22,24.25 C14.2
  Bottom 3.2: J1.6 J1.7 30.79,9.78 30.77,9.8 33.27,12.3 36.77,12.3 39.17,9.9 J1.9 J1.4
N$1
  Bottom 0.2: R12.2 R13.2 60.77,18.7 | 60.77,18.7 R15.2 R14.2 | 60.77,18.7 C14.1
N$5
  Top 0.2: IC2.2 51.27,17.8 52.27,17.8 53.77,16.3 R7.1 54.02,16.3 54.02,13.3 R9.2
N$6
  Top 0.2: C8.1 51.27,13.3 51.27,17.05 IC2.1
N$7
  Top 3.2: J1.3 J1.10
  Bottom 3.2: J1.3 J1.10
N$10
  Top 0.2: R6.1 10.82,14.8 D3.A
N$11
  Top 0.2: IC2.3 51.27,18.8 53.27,18.8 53.77,19.3 R8.2
N$15
  Top 0.2: R10.1 36.27,17.8 35.27,16.8 33.52,16.8 IC3.8 33.27,16.8 32.02,16.8 32.02,20.8 R11.2
N$17
  Top 0.2: R5.1 10.32,17.8 D2.A
N$40
  Top 0.2: 34.52,26.3 32.02,23.8 C3.1 | 34.52,26.3 37.02,26.3 U1.5 | 34.52,26.3 34.27,26.3 33.77,26.8 R1.1
N$42
  Top 0.2: D1.A 9.82,20.8 R4.1
N$61
  Top 0.2: U1.31 39.27,31.55 39.77,32.05 40.02,32.05 40.02,34.3 R3.1
NRST  (via drill 0.35)
  Top 0.2: 27.27,34.8 23.77,34.8 C2.1 23.77,34.55 23.52,34.3 22.63,34.3 22.13,33.8 22.13,31.95 22.67,31.4 31.92,31.4 33.52,29.8 R2.1 33.77,29.8 33.77,27.8 35.02,27.8 35.52,27.3 37.02,27.3 U1.4 37.27,27.05 v39.02,27.05 | 27.27,34.8 31.27,34.8 S1.4 | 27.27,34.8 S1.3 | v51.52,22.3 65.03,22.3 68.03,25.3 69.68,25.3 70.64,26.26 SWD1.3
  Bottom 0.2: v51.52,22.3 43.77,22.3 v39.02,27.05
R  (via drill 0.35)
  Top 0.2: v41.02,24.05 44.02,27.05 45.27,27.05 U1.21 | v30.52,14.05 29.27,12.8 28.27,12.8 IC3.4
  Bottom 0.2: v41.02,24.05 40.52,24.05 31.27,14.8 v30.52,14.05
RS  (via drill 0.35)
  Top 0.2: v35.77,28.05 37.02,28.05 U1.3 | v36.02,20.55 37.02,20.55 38.12,19.45 R10.2
  Bottom 0.2: v36.02,20.55 36.02,27.8 v35.77,28.05
RX  (via drill 0.35)
  Top 0.2: U1.25 44.07,29.6 v43.27,28.8 | v21.77,28.3 18.29,28.3 J3.3
  Bottom 0.2: v21.77,28.3 22.27,28.8 34.28,28.8 35.38,29.9 38.92,29.9 40.02,28.8 v43.27,28.8
SBUS
  Top 0.2: IC1.2 47.77,33.55 47.27,33.55 45.77,35.05 45.77,39.3 MOD1.3
SBUS_INV  (via drill 0.35)
  Top 0.2: v49.27,32.05 50.27,32.05 50.52,32.3 IC1.4 | v49.27,28.05 47.77,26.55 45.52,26.55 U1.20
  Bottom 0.2: v49.27,28.05 v49.27,32.05
SWDCLK  (via drill 0.35)
  Top 0.2: v74.78,26.8 74.53,26.8 74.03,26.3 SWD1.4 | v53.02,29.55 45.52,29.55 U1.24
  Bottom 0.2: v74.78,26.8 55.77,26.8 v53.02,29.55
SWDIO
  Top 0.2: U1.23 54.52,28.8 56.27,27.05 65.03,27.05 68.53,30.55 73.73,30.55 75.03,29.26 75.03,28.3 74.03,27.3 SWD1.2
SWO  (via drill 0.35)
  Top 0.2: SWD1.6 74.97,24.99 v75.28,25.3 | v54.27,29.8 53.67,29.8 53.29,30.18 52.76,30.18 52.49,29.9 46.44,29.9 44.43,31.9 43.72,31.9 43.27,31.46 U1.26
  Bottom 0.2: v75.28,25.3 75.28,26.41 75.41,26.54 75.41,27.06 75.04,27.43 74.51,27.43 74.24,27.15 56.92,27.15 v54.27,29.8
TX  (via drill 0.35)
  Top 0.2: U1.8 35.46,22.3 v34.77,22.3 | v20.27,29.3 19.77,29.8 18.27,29.8 J3.4
  Bottom 0.2: v34.77,22.3 33.27,20.8 27.27,20.8 20.27,27.8 v20.27,29.3

### Text on the board
tPlace: R_RCU | UART | 3.3V | 5V | 12V | RCU / Rev2, 2020.09.27 | Autonomous WaveRunner
bPlace: Termination
tDocu: 3V3 | 12V | 5V